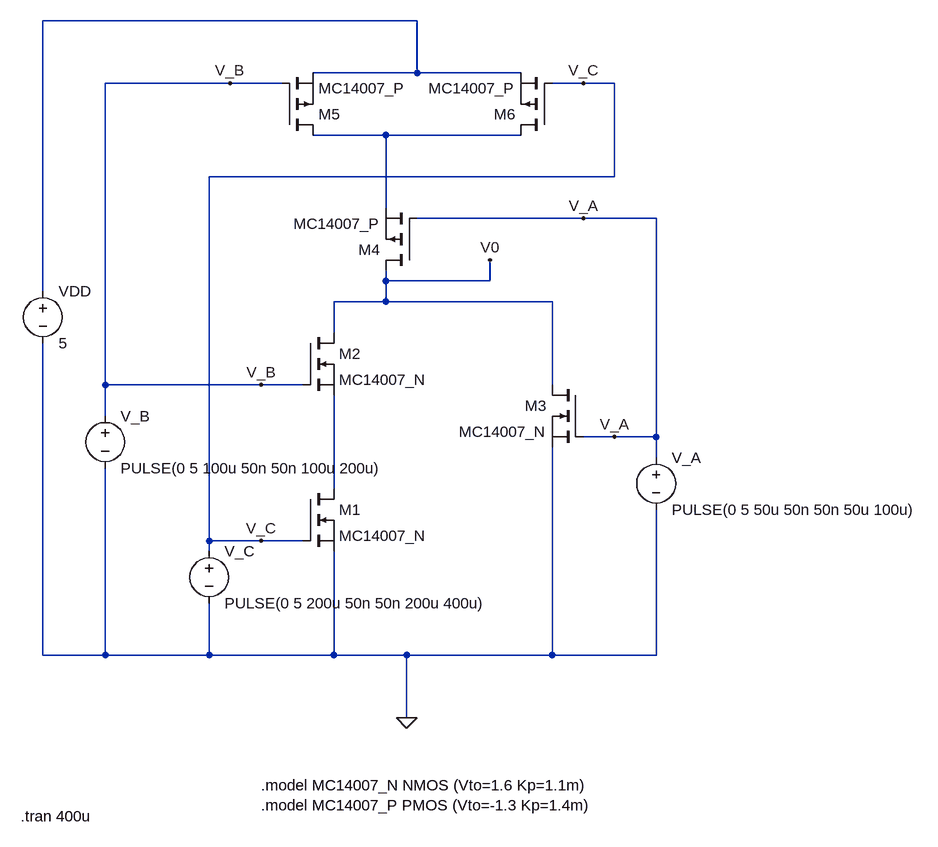
[diagram p0: schematic 1.4.1.asc]
1.4.1.asc, the LTspice schematic file:
Version 4
SHEET 1 1260 936
WIRE 464 -304 -112 -304
WIRE 464 -224 464 -304
WIRE 464 -224 304 -224
WIRE 624 -224 464 -224
WIRE 176 -208 -16 -208
WIRE 256 -208 176 -208
WIRE 720 -208 672 -208
WIRE 768 -208 720 -208
WIRE 416 -128 304 -128
WIRE 624 -128 416 -128
WIRE 768 -64 768 -208
WIRE 768 -64 144 -64
WIRE 416 -16 416 -128
WIRE 720 0 464 0
WIRE 832 0 720 0
WIRE 416 96 416 80
WIRE 576 96 576 64
WIRE 576 96 416 96
WIRE -112 112 -112 -304
WIRE 416 128 416 96
WIRE 416 128 336 128
WIRE 672 128 416 128
WIRE 336 176 336 128
WIRE -16 256 -16 -208
WIRE 224 256 -16 256
WIRE 288 256 224 256
WIRE 672 256 672 128
WIRE -16 304 -16 256
WIRE 768 336 720 336
WIRE 832 336 832 0
WIRE 832 336 768 336
WIRE 832 368 832 336
WIRE 336 416 336 272
WIRE 144 496 144 -64
WIRE 224 496 144 496
WIRE 288 496 224 496
WIRE 144 512 144 496
WIRE -112 672 -112 192
WIRE -16 672 -16 384
WIRE -16 672 -112 672
WIRE 144 672 144 592
WIRE 144 672 -16 672
WIRE 336 672 336 512
WIRE 336 672 144 672
WIRE 448 672 336 672
WIRE 672 672 672 352
WIRE 672 672 448 672
WIRE 832 672 832 448
WIRE 832 672 672 672
WIRE 448 768 448 672
FLAG 448 768 0
FLAG 720 0 V_A
FLAG 224 256 V_B
FLAG 176 -208 V_B
FLAG 768 336 V_A
FLAG 224 496 V_C
FLAG 720 -208 V_C
FLAG 576 64 V0
SYMBOL voltage -112 96 R0
SYMATTR InstName VDD
SYMATTR Value 5
SYMBOL voltage -16 288 R0
SYMATTR InstName V_B
SYMATTR Value PULSE(0 5 100u 50n 50n 100u 200u)
SYMBOL voltage 144 496 R0
SYMATTR InstName V_C
SYMATTR Value PULSE(0 5 200u 50n 50n 200u 400u)
SYMBOL voltage 832 352 R0
SYMATTR InstName V_A
SYMATTR Value PULSE(0 5 50u 50n 50n 50u 100u)
SYMBOL nmos 288 416 R0
SYMATTR InstName M1
SYMATTR Value MC14007_N
SYMBOL nmos 288 176 R0
SYMATTR InstName M2
SYMATTR Value MC14007_N
SYMBOL nmos 720 256 M0
SYMATTR InstName M3
SYMATTR Value MC14007_N
SYMBOL pmos 464 80 R180
SYMATTR InstName M4
SYMATTR Value MC14007_P
SYMBOL pmos 672 -128 R180
SYMATTR InstName M6
SYMATTR Value MC14007_P
SYMBOL pmos 256 -128 M180
SYMATTR InstName M5
SYMATTR Value MC14007_P
TEXT 224 872 Left 2 !.model MC14007_N NMOS (Vto=1.6 Kp=1.1m)\n.model MC14007_P PMOS (Vto=-1.3 Kp=1.4m)
TEXT -146 920 Left 2 !.tran 400u

The netlist it stands for:
* 1.4.1.asc
VDD N001 0 5
V_B V_B 0 PULSE(0 5 100u 50n 50n 100u 200u)
V_C V_C 0 PULSE(0 5 200u 50n 50n 200u 400u)
V_A V_A 0 PULSE(0 5 50u 50n 50n 50u 100u)
M1 N003 V_C 0 0 MC14007_N
M2 V0 V_B N003 N003 MC14007_N
M3 V0 V_A 0 0 MC14007_N
M4 V0 V_A N002 N002 MC14007_P
M6 N002 V_C N001 N001 MC14007_P
M5 N002 V_B N001 N001 MC14007_P
.model NMOS NMOS
.model PMOS PMOS
.lib standard.mos
.model MC14007_N NMOS (Vto=1.6 Kp=1.1m)
.model MC14007_P PMOS (Vto=-1.3 Kp=1.4m)
.tran 400u
.backanno
.end